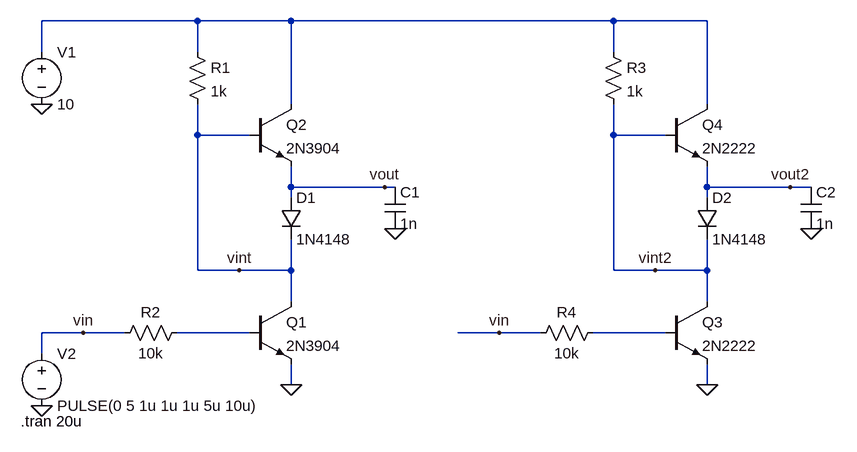
[diagram p0: schematic push-pull.asc]
push-pull.asc, the LTspice schematic file:
Version 4
SHEET 1 1016 680
WIRE 32 -240 -208 -240
WIRE 176 -240 32 -240
WIRE 672 -240 176 -240
WIRE 816 -240 672 -240
WIRE -208 -192 -208 -240
WIRE 32 -192 32 -240
WIRE 672 -192 672 -240
WIRE 176 -112 176 -240
WIRE 816 -112 816 -240
WIRE 32 -64 32 -112
WIRE 112 -64 32 -64
WIRE 672 -64 672 -112
WIRE 752 -64 672 -64
WIRE 176 16 176 -16
WIRE 320 16 176 16
WIRE 336 16 320 16
WIRE 816 16 816 -16
WIRE 944 16 816 16
WIRE 976 16 944 16
WIRE 176 32 176 16
WIRE 816 32 816 16
WIRE 32 144 32 -64
WIRE 96 144 32 144
WIRE 176 144 176 96
WIRE 176 144 96 144
WIRE 672 144 672 -64
WIRE 736 144 672 144
WIRE 816 144 816 96
WIRE 816 144 736 144
WIRE 176 192 176 144
WIRE 816 192 816 144
WIRE -144 240 -208 240
WIRE -80 240 -144 240
WIRE 112 240 0 240
WIRE 496 240 432 240
WIRE 560 240 496 240
WIRE 752 240 640 240
WIRE -208 272 -208 240
WIRE 176 320 176 288
WIRE 816 320 816 288
FLAG 176 320 0
FLAG -208 -112 0
FLAG -208 352 0
FLAG 336 80 0
FLAG 320 16 vout
FLAG 96 144 vint
FLAG -144 240 vin
FLAG 816 320 0
FLAG 976 80 0
FLAG 736 144 vint2
FLAG 944 16 vout2
FLAG 496 240 vin
SYMBOL npn 112 192 R0
SYMATTR InstName Q1
SYMATTR Value 2N3904
SYMBOL npn 112 -112 R0
SYMATTR InstName Q2
SYMATTR Value 2N3904
SYMBOL diode 160 32 R0
SYMATTR InstName D1
SYMATTR Value 1N4148
SYMBOL res 16 -208 R0
SYMATTR InstName R1
SYMATTR Value 1k
SYMBOL voltage -208 -208 R0
WINDOW 123 0 0 Left 0
WINDOW 39 0 0 Left 0
SYMATTR InstName V1
SYMATTR Value 10
SYMBOL voltage -208 256 R0
WINDOW 123 0 0 Left 0
WINDOW 39 0 0 Left 0
SYMATTR InstName V2
SYMATTR Value PULSE(0 5 1u 1u 1u 5u 10u)
SYMBOL res 16 224 R90
WINDOW 0 0 56 VBottom 2
WINDOW 3 32 56 VTop 2
SYMATTR InstName R2
SYMATTR Value 10k
SYMBOL cap 320 16 R0
SYMATTR InstName C1
SYMATTR Value 1n
SYMBOL npn 752 192 R0
SYMATTR InstName Q3
SYMATTR Value 2N2222
SYMBOL npn 752 -112 R0
SYMATTR InstName Q4
SYMATTR Value 2N2222
SYMBOL diode 800 32 R0
SYMATTR InstName D2
SYMATTR Value 1N4148
SYMBOL res 656 -208 R0
SYMATTR InstName R3
SYMATTR Value 1k
SYMBOL res 656 224 R90
WINDOW 0 0 56 VBottom 2
WINDOW 3 32 56 VTop 2
SYMATTR InstName R4
SYMATTR Value 10k
SYMBOL cap 960 16 R0
SYMATTR InstName C2
SYMATTR Value 1n
TEXT -240 376 Left 2 !.tran 20u

The netlist it stands for:
* push-pull.asc
Q1 vint N002 0 0 2N3904
Q2 N001 vint vout 0 2N3904
D1 vout vint 1N4148
R1 N001 vint 1k
V1 N001 0 10
V2 vin 0 PULSE(0 5 1u 1u 1u 5u 10u)
R2 N002 vin 10k
C1 vout 0 1n
Q3 vint2 N003 0 0 2N2222
Q4 N001 vint2 vout2 0 2N2222
D2 vout2 vint2 1N4148
R3 N001 vint2 1k
R4 N003 vin 10k
C2 vout2 0 1n
.model D D
.lib standard.dio
.model NPN NPN
.model PNP PNP
.lib standard.bjt
.tran 20u
.backanno
.end